# Altium schematic sheet microphone_thingy.schdoc
size 151 x 86 mm
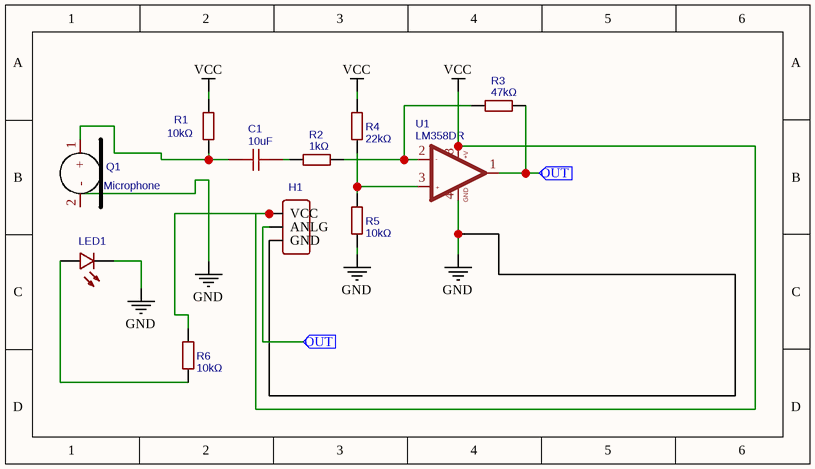
[diagram p0: microphone_thingy.schdoc]

## Parts
C1  10uF  [C0805]
H1  Header-Male-2.54_1x3  [HDR-TH_3P-P2.54-V-M-1]  (value not drawn)
LED1  19-217/BHC-ZL1M2RY/3T  [LED0603-RD]  (value not drawn)
Q1  Microphone  [MICROPHONE]
R1  10kΩ  [R0402]
R2  1kΩ  [R0402]
R3  47kΩ  [R0402]
R4  22kΩ  [R0402]
R5  10kΩ  [R0402]
R6  10kΩ  [R0402]
U1  LM358DR  [SOIC-8_L5.0-W4.0-P1.27-LS6.0-BL]

## Ports
OUT (in)

## Nets
GND: H1.3(GND) LED1.1(C) Q1.2(-) R5.1 U1.4(GND)
VCC: H1.1(VCC) R1.2 R4.2 R6.2 U1.8(+V)
OUT: H1.2(ANLG) R3.2 U1.1(OUT1) ; port OUT
NetC1_1: C1.1 Q1.1(+) R1.1
NetC1_2: C1.2 R2.1
NetLED1_2: LED1.2(A) R6.1
NetR2_2: R2.2 R3.1 U1.2(-IN1)
NetR4_1: R4.1 R5.2 U1.3(+IN1)

## Notes on the sheet
- (in symbol LM358DR) -; +

## Library data of the parts
C1 = 10uF: Manufacturer Part: CL21A106KAYNNNE; Manufacturer: SAMSUNG(三星); nameAlias: Value; Supplier: LCSC; Supplier Part: C15850; spicePre: C; spiceSymbolName: CL21A106KAYNNNE
H1 = Header-Male-2.54_1x3: Manufacturer: BOOMELE(博穆精密); Manufacturer Part: 2.54-1*3P针; Supplier: LCSC; Supplier Part: C49257; JLCPCB Part Class: Extended Part; spicePre: H; spiceSymbolName: Header-Male-2.54_1x3
LED1 = 19-217/BHC-ZL1M2RY/3T: Manufacturer: EVERLIGHT(亿光); Supplier: LCSC; Manufacturer Part: 19-217/BHC-ZL1M2RY/3T; Supplier Part: C72041; JLCPCB Part Class: Basic Part; spicePre: L; spiceSymbolName: 19-217/BHC-ZL1M2RY/3T
Q1 = Microphone: Contributor: Мастерская Ленара; spicePre: Q; spiceSymbolName: Microphone
R1 R5 R6 = 10kΩ: Manufacturer: YAGEO(国巨); Manufacturer Part: RC0402FR-0710KL; nameAlias: Value; Supplier: LCSC; Supplier Part: C60490; JLCPCB Part Class: Extended Part; spicePre: R; spiceSymbolName: RC0402FR-0710KL
R2 = 1kΩ: Manufacturer: UNI-ROYAL(厚声); Manufacturer Part: 0402WGF1001TCE; nameAlias: Value; Supplier: LCSC; Supplier Part: C11702; JLCPCB Part Class: Basic Part; spicePre: R; spiceSymbolName: 0402WGF1001TCE
R3 = 47kΩ: Manufacturer: UNI-ROYAL(厚声); Manufacturer Part: 0402WGF4702TCE; nameAlias: Value; Supplier: LCSC; Supplier Part: C25792; JLCPCB Part Class: Basic Part; spicePre: R; spiceSymbolName: 0402WGF4702TCE
R4 = 22kΩ: Manufacturer: UNI-ROYAL(厚声); Manufacturer Part: 0402WGF2202TCE; nameAlias: Value; Supplier: LCSC; Supplier Part: C25768; JLCPCB Part Class: Basic Part; spicePre: R; spiceSymbolName: 0402WGF2202TCE
U1 = LM358DR: subpart_no: 1; Manufacturer: TI(德州仪器); tags: General Operational Amplifier; sourceId: LDdaKIigs; SMT Type: Extend; SeeedStudio: 310020021; timeStamp: 1448067236; image: http://image.lceda.cn/szlcsc/C5423.jpg; Supplier Part: C5423; Supplier: LCSC; Manufacturer Part: LM358DR; LCSC Assembly: Yes; JLCPCB Part Class: Extended Part; spicePre: U; spiceSymbolName: LM358DR